# Altium schematic sheet Sheet3.SchDoc
size A3; SheetNumber: 2; SheetTotal: 2
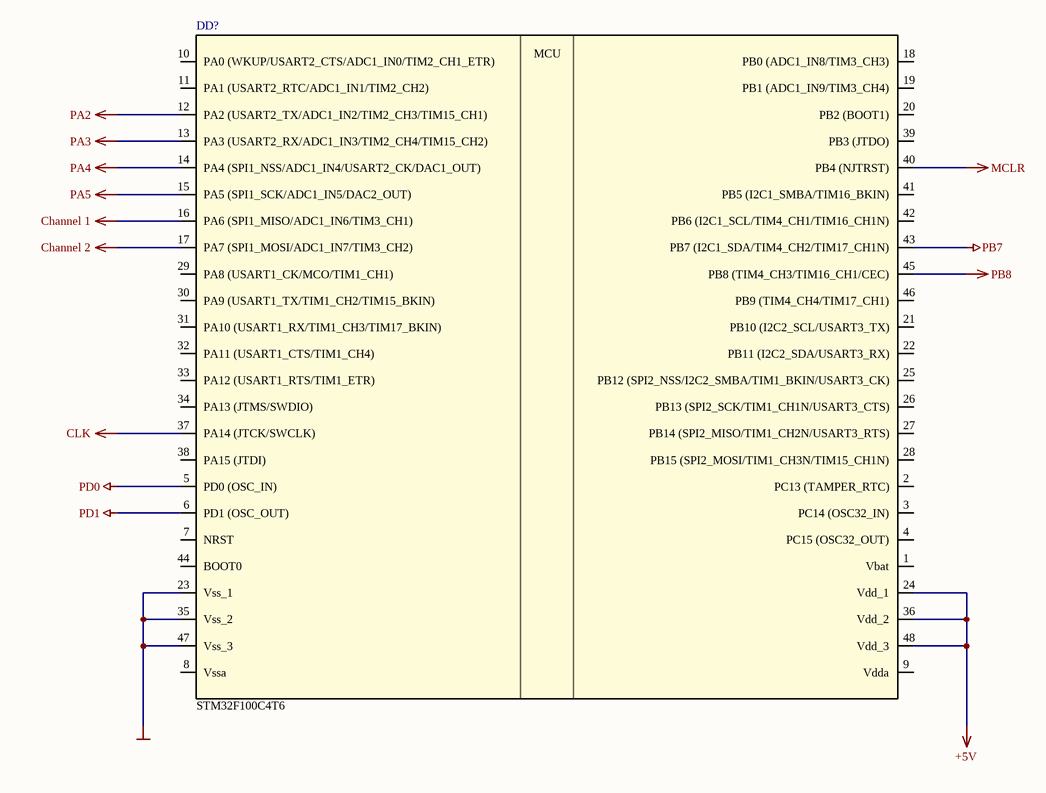
[diagram p0: Sheet3.SchDoc]

## Parts
DD?  STM32F100C4T6  [TQFP48 S0.5]

## Nets
+5V: DD?.24(Vdd_1) DD?.36(Vdd_2) DD?.48(Vdd_3)
-5: DD?.23(Vss_1) DD?.35(Vss_2) DD?.47(Vss_3)
Channel 1: DD?.16(PA6_(SPI1_MISO/ADC1_IN6/TIM3_CH1))
Channel 2: DD?.17(PA7_(SPI1_MOSI/ADC1_IN7/TIM3_CH2))
CLK: DD?.37(PA14_(JTCK/SWCLK))
MCLR: DD?.40(PB4_(NJTRST))
PA2: DD?.12(PA2_(USART2_TX/ADC1_IN2/TIM2_CH3/TIM15_CH1))
PA3: DD?.13(PA3_(USART2_RX/ADC1_IN3/TIM2_CH4/TIM15_CH2))
PA4: DD?.14(PA4_(SPI1_NSS/ADC1_IN4/USART2_CK/DAC1_OUT))
PA5: DD?.15(PA5_(SPI1_SCK/ADC1_IN5/DAC2_OUT))
PB7: DD?.43(PB7_(I2C1_SDA/TIM4_CH2/TIM17_CH1N))
PB8: DD?.45(PB8_(TIM4_CH3/TIM16_CH1/CEC))
PD0: DD?.5(PD0_(OSC_IN))
PD1: DD?.6(PD1_(OSC_OUT))

Not connected (* = marked no-connect by the designer): DD? 1(Vbat) 2(PC13_(TAMPER_RTC)) 3(PC14_(OSC32_IN)) 4(PC15_(OSC32_OUT)) 7(NRST) 8(Vssa) 9(Vdda) 10(PA0_(WKUP/USART2_CTS/ADC1_IN0/TIM2_CH1_ETR)) 11(PA1_(USART2_RTC/ADC1_IN1/TIM2_CH2)) 18(PB0_(ADC1_IN8/TIM3_CH3)) 19(PB1_(ADC1_IN9/TIM3_CH4)) 20(PB2_(BOOT1)) 21(PB10_(I2C2_SCL/USART3_TX)) 22(PB11_(I2C2_SDA/USART3_RX)) 25(PB12_(SPI2_NSS/I2C2_SMBA/TIM1_BKIN/USART3_CK)) 26(PB13_(SPI2_SCK/TIM1_CH1N/USART3_CTS)) 27(PB14_(SPI2_MISO/TIM1_CH2N/USART3_RTS)) 28(PB15_(SPI2_MOSI/TIM1_CH3N/TIM15_CH1N)) 29(PA8_(USART1_CK/MCO/TIM1_CH1)) 30(PA9_(USART1_TX/TIM1_CH2/TIM15_BKIN)) 31(PA10_(USART1_RX/TIM1_CH3/TIM17_BKIN)) 32(PA11_(USART1_CTS/TIM1_CH4)) 33(PA12_(USART1_RTS/TIM1_ETR)) 34(PA13_(JTMS/SWDIO)) 38(PA15_(JTDI)) 39(PB3_(JTDO)) 41(PB5_(I2C1_SMBA/TIM16_BKIN)) 42(PB6_(I2C1_SCL/TIM4_CH1/TIM16_CH1N)) 44(BOOT0) 46(PB9_(TIM4_CH4/TIM17_CH1))

## Notes on the sheet
- (in symbol STM32F100C4T6) MCU